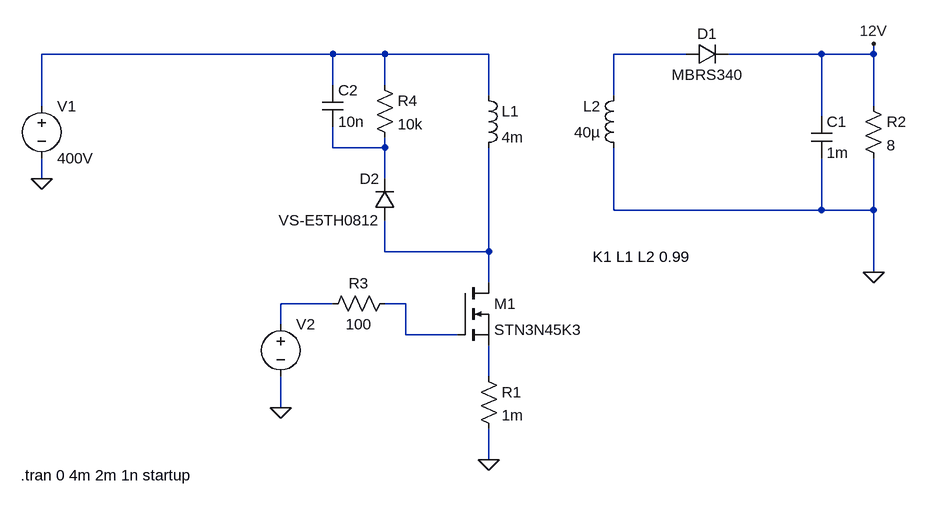
[diagram p0: schematic Psu_Sim.asc]
Psu_Sim.asc, the LTspice schematic file:
Version 4.1
SHEET 1 1472 856
WIRE -16 48 -464 48
WIRE 64 48 -16 48
WIRE 224 48 64 48
WIRE 528 48 416 48
WIRE 736 48 592 48
WIRE 816 48 816 32
WIRE 816 48 736 48
WIRE -16 96 -16 48
WIRE 64 96 64 48
WIRE 224 112 224 48
WIRE 416 112 416 48
WIRE -464 128 -464 48
WIRE 816 128 816 48
WIRE 736 144 736 48
WIRE -16 192 -16 160
WIRE 64 192 64 176
WIRE 64 192 -16 192
WIRE -464 240 -464 208
WIRE 64 240 64 192
WIRE 416 288 416 192
WIRE 736 288 736 208
WIRE 736 288 416 288
WIRE 816 288 816 208
WIRE 816 288 736 288
WIRE 64 352 64 304
WIRE 224 352 224 192
WIRE 224 352 64 352
WIRE 816 384 816 288
WIRE 224 400 224 352
WIRE -16 432 -96 432
WIRE 96 432 64 432
WIRE -96 464 -96 432
WIRE 96 480 96 432
WIRE 176 480 96 480
WIRE 224 544 224 496
WIRE -96 592 -96 544
WIRE 224 672 224 624
FLAG 816 384 0
FLAG 224 672 0
FLAG -464 240 0
FLAG 816 32 12V
FLAG -96 592 0
SYMBOL ind 208 96 R0
SYMATTR InstName L1
SYMATTR Value 4m
SYMATTR Type ind
SYMBOL ind 432 208 R180
WINDOW 0 36 80 Left 2
WINDOW 3 36 40 Left 2
SYMATTR InstName L2
SYMATTR Value 40µ
SYMATTR Type ind
SYMBOL res 800 112 R0
SYMATTR InstName R2
SYMATTR Value 8
SYMBOL cap 720 144 R0
SYMATTR InstName C1
SYMATTR Value 1m
SYMBOL res 208 528 R0
SYMATTR InstName R1
SYMATTR Value 1m
SYMBOL voltage -464 112 R0
WINDOW 123 0 0 Left 0
WINDOW 39 0 0 Left 0
SYMATTR InstName V1
SYMATTR Value 400V
SYMBOL diode 80 304 R180
WINDOW 0 24 64 Left 2
WINDOW 3 24 0 Left 2
SYMATTR InstName D2
SYMATTR Value VS-E5TH0812
SYMBOL res 48 80 R0
SYMATTR InstName R4
SYMATTR Value 10k
SYMBOL cap -32 96 R0
SYMATTR InstName C2
SYMATTR Value 10n
SYMBOL voltage -96 448 R0
WINDOW 3 -191 125 Invisible 2
WINDOW 123 0 0 Left 0
WINDOW 39 0 0 Left 0
SYMATTR InstName V2
SYMATTR Value PULSE(0 15 1n 1n 1n 4.1u 16.66u 10e6)
SYMBOL diode 528 64 R270
WINDOW 0 32 32 VTop 2
WINDOW 3 0 32 VBottom 2
SYMATTR InstName D1
SYMATTR Value MBRS340
SYMBOL res 80 416 R90
WINDOW 0 0 56 VBottom 2
WINDOW 3 32 56 VTop 2
SYMATTR InstName R3
SYMATTR Value 100
SYMBOL nmos 176 400 R0
SYMATTR InstName M1
SYMATTR Value STN3N45K3
TEXT 384 360 Left 2 !K1 L1 L2 0.99
TEXT -496 696 Left 2 !.tran 0 4m 2m 1n startup

The netlist it stands for:
* Psu_Sim.asc
L1 N001 N004 4m
L2 0 N002 40µ
R2 12V 0 8
C1 12V 0 1m
R1 N007 0 1m
V1 N001 0 400V
D2 N004 N003 VS-E5TH0812
R4 N001 N003 10k
C2 N001 N003 10n
V2 N005 0 PULSE(0 15 1n 1n 1n 4.1u 16.66u 10e6)
D1 N002 12V MBRS340
R3 N006 N005 100
M1 N004 N006 N007 N007 STN3N45K3
.model D D
.lib standard.dio
.model NMOS NMOS
.model PMOS PMOS
.lib standard.mos
K1 L1 L2 0.99
.tran 0 4m 2m 1n startup
.backanno
.end